# Altium schematic sheet dtb-222-connectors.SchDoc
size 381 x 241 mm; SheetNumber: 2; SheetTotal: 3
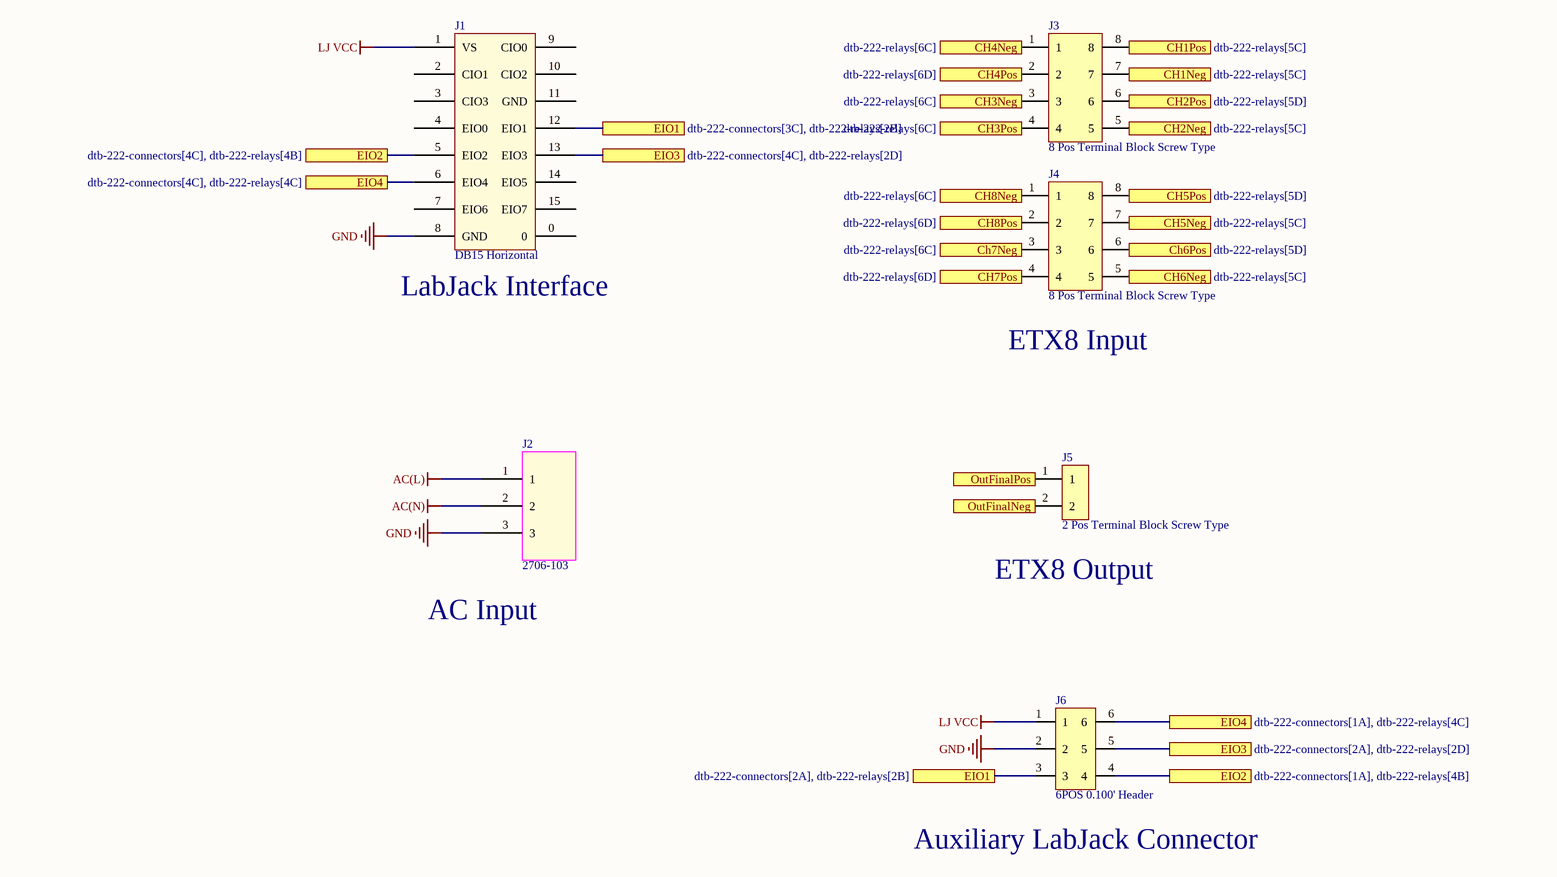
[diagram p0: dtb-222-connectors.SchDoc]

## Parts
?  (no value)  (graphical)
J1  DB15 Horizontal  [182-015-113R531]
J2  2706-103  [2706-103]
J3  8 Pos Terminal Block Screw Type  [TB008A-508-08BE]
J4  8 Pos Terminal Block Screw Type  [TB008A-508-08BE]
J5  2 Pos Terminal Block Screw Type  [TB008A-508-02BE]
J6  6POS 0.100' Header  [67997-206HLF]

## Ports
CH1Neg (see dtb-222-relays[5C]), CH1Pos (see dtb-222-relays[5C]), CH2Neg (see dtb-222-relays[5C]), CH2Pos (see dtb-222-relays[5D]), CH3Neg (see dtb-222-relays[6C]), CH3Pos (see dtb-222-relays[6C]), CH4Neg (see dtb-222-relays[6C]), CH4Pos (see dtb-222-relays[6D]), CH5Neg (see dtb-222-relays[5C]), CH5Pos (see dtb-222-relays[5D]), CH6Neg (see dtb-222-relays[5C]), Ch6Pos (see dtb-222-relays[5D]), Ch7Neg (see dtb-222-relays[6C]), CH7Pos (see dtb-222-relays[6D]), CH8Neg (see dtb-222-relays[6C]), CH8Pos (see dtb-222-relays[6D]), EIO1 (see dtb-222-connectors[2A], dtb-222-relays[2B]), EIO1 (see dtb-222-connectors[3C], dtb-222-relays[2B]), EIO2 (see dtb-222-connectors[1A], dtb-222-relays[4B]), EIO2 (see dtb-222-connectors[4C], dtb-222-relays[4B]), EIO3 (see dtb-222-connectors[2A], dtb-222-relays[2D]), EIO3 (see dtb-222-connectors[4C], dtb-222-relays[2D]), EIO4 (see dtb-222-connectors[1A], dtb-222-relays[4C]), EIO4 (see dtb-222-connectors[4C], dtb-222-relays[4C]), OutFinalNeg (see dtb-222-relays[3B]), OutFinalPos (see dtb-222-relays[3B])

## Nets
AC(L): J2.1
AC(N): J2.2
GND: J1.8(GND) J2.3 J6.2
LJ VCC: J1.1(VS) J6.1
CH1Neg: J3.7 ; port CH1Neg
CH1Pos: J3.8 ; port CH1Pos
CH2Neg: J3.5 ; port CH2Neg
CH2Pos: J3.6 ; port CH2Pos
CH3Neg: J3.3 ; port CH3Neg
CH3Pos: J3.4 ; port CH3Pos
CH4Neg: J3.1 ; port CH4Neg
CH4Pos: J3.2 ; port CH4Pos
CH5Neg: J4.7 ; port CH5Neg
CH5Pos: J4.8 ; port CH5Pos
CH6Neg: J4.5 ; port CH6Neg
Ch6Pos: J4.6 ; port Ch6Pos
Ch7Neg: J4.3 ; port Ch7Neg
CH7Pos: J4.4 ; port CH7Pos
CH8Neg: J4.1 ; port CH8Neg
CH8Pos: J4.2 ; port CH8Pos
EIO1: J1.12(EIO1) J6.3 ; port EIO1
EIO2: J1.5(EIO2) J6.4 ; port EIO2
EIO3: J1.13(EIO3) J6.5 ; port EIO3
EIO4: J1.6(EIO4) J6.6 ; port EIO4
OutFinalNeg: J5.2 ; port OutFinalNeg
OutFinalPos: J5.1 ; port OutFinalPos

Not connected (* = marked no-connect by the designer): J1 0 2(CIO1) 3(CIO3) 4(EIO0) 7(EIO6) 9(CIO0) 10(CIO2) 11(GND) 14(EIO5) 15(EIO7)

## Notes on the sheet
- (near J1) LabJack Interface
- (near J4) ETX8 Input
- AC Input
- (near J5) ETX8 Output
- (near J6) Auxiliary LabJack Connector
- Size
- Title
- B
- Project
- Rev
- Date:
- Sheet
- of

## Library data of the parts
? = VoltServer Title Block
J1 = DB15 LabJack Pinout: 15 Position D-Sub Plug, Male Pins Connector; Manufacturer: NorComp Inc.; Vendor: Digikey; Vendor PN: 182-15ME-ND; Value: DB 16 Male; Manufacturer PN: 182-015-113R531
J2 = 2706-103: 3 Position Wire to Board Terminal Block Horizontal with Board 0.295" (7.50mm) Through Hole; Manufacturer: WAGO Corporation; Value: 3-Pos Terminal Block Horizontal; Vendor: Digi-Key; Vendor PN: 2946-2706-103-ND; Manufacturer PN: 2706-103
J3 J4 = TB008A-508-08BE: 8 Position Wire to Board Terminal Block 45° (135°) Angle with Board 0.200" (5.08mm) Through Hole; Manufacturer: CUI Devices; Manufacturer PN: TB008A-508-08DE; Vendor: Digi-Key; Vendor PN: 102-6216-ND; Value: 8 pos screw terminal
J5 = TB008A-508-02BE: 2 Position Wire to Board Terminal Block 45° (135°) Angle with Board 0.200" (5.08mm) Through Hole; Manufacturer: CUI Devices; Manufacturer PN: TB008A-508-02DE; Vendor: Digi-Key; Vendor PN: 102-6213-ND; Value: 2 pos screw terminal
J6 = 67997-206HLF: Connector Header Through Hole 6 position 0.100" (2.54mm); Manufacturer: Amphenol ICC (FCI); Vendor: Digi-Key; Vendor PN: 609-3234-ND; Value: CONN HEADER VERT 6POS 2.54MM; Manufacturer PN: 67997-206HLF